# Altium schematic sheet Sheet1.SchDoc
size A4
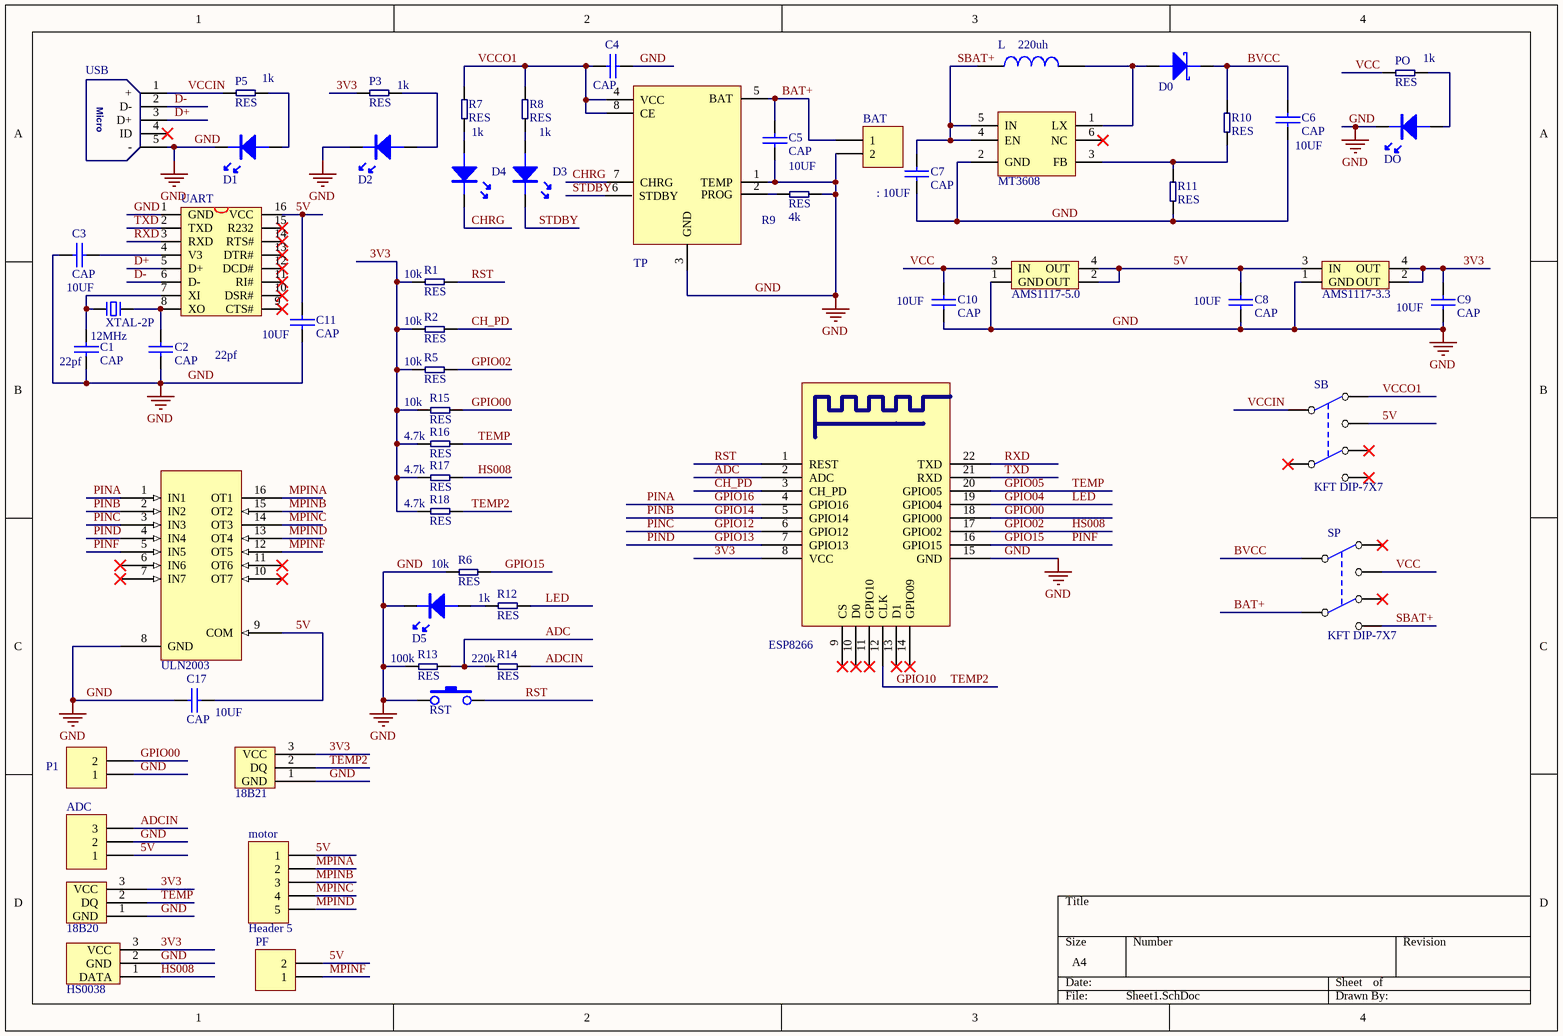
[diagram p0: Sheet1.SchDoc]

## Parts
18B20  DS18B20  [DS18B20]  (value not drawn)
18B21  DS18B20  [DS18B20]  (value not drawn)
ADC  Header 3  [HDR1X3]  (value not drawn)
AMS117  AMS1117-3.3  [AMS1117]
AMS117-1  AMS1117-5.0  [AMS1117]
BAT  Header 2  [HDR1X2]  (value not drawn)
C1  CAP  [0805C]
C2  CAP  [0805C]
C3  CAP  [0805C]
C4  CAP  [0805C]
C5  CAP  [0805C]
C6  CAP  [0805C]
C7  CAP  [0805C]
C8  CAP  [0805C]
C9  CAP  [0805C]
C10  CAP  [0805C]
C11  CAP  [0805C]
C17  CAP  [0805C]
D0  DIODE SCHOTTKY  [SMA/DO-214AC]  (value not drawn)
D1  LED  [LED-0805R]  (value not drawn)
D2  LED  [LED-0805R]  (value not drawn)
D3  LED  [LED-0805R]  (value not drawn)
D4  LED  [LED-0805R]  (value not drawn)
D5  LED  [LED-0805R]  (value not drawn)
DO  LED  [LED-0805R]  (value not drawn)
ESP8266  ESP8266  [ESP_12]
HS0038  HS0038  [HS0038]  (value not drawn)
L  INDUCTOR  [CD54]  (value not drawn)
motor  Header 5  [HDR1X5]
MT  MT3608  [SOT23-6]
P1  Header 2  [HDR1X2]  (value not drawn)
P3  RES  [0805R]
P5  RES  [0805R]
PF  Header 2  [HDR1X2]  (value not drawn)
PO  RES  [0805R]
R1  RES  [0805R]
R2  RES  [0805R]
R5  RES  [0805R]
R6  RES  [0805R]
R7  RES  [0805R]
R8  RES  [0805R]
R9  RES  [0805R]
R10  RES  [0805R]
R11  RES  [0805R]
R12  RES  [0805R]
R13  RES  [0805R]
R14  RES  [0805R]
R15  RES  [0805R]
R16  RES  [0805R]
R17  RES  [0805R]
R18  RES  [0805R]
RST  KEY  [DIP-3X6X4.3]  (value not drawn)
SB  KFT DIP-7X7  [KFT DIP-7X7]
SP  KFT DIP-7X7  [KFT DIP-7X7]
TP  TP4056  [SOP-8]  (value not drawn)
UART  CH340G  [SOP16M]  (value not drawn)
ULN2003  ULN2003  [SOP16]
USB  Micro-USB  [USB-MICRO_A]  (value not drawn)
X  XTAL-2P  [OSC HC-49S]

## Nets
GND: 18B20.1(GND) 18B21.1(GND) ADC.2 AMS117.1(GND) AMS117-1.1(GND) BAT.2 C1.1 C2.1 C3.2 C4.2 C5.1 C6.1 C7.1 C8.1 C9.1 C10.1 C11.1 C17.1 D1.K D2.K D5.K DO.K ESP8266.15(GND) HS0038.2(GND) MT.2(GND) P1.1 R6.1 R9.1 R11.2 R13.1 RST.1 TP.1(TEMP) TP.3(GND) UART.1(GND) ULN2003.8(GND) USB.5(-)
3V3: 18B20.3(VCC) 18B21.3(VCC) AMS117.2(OUT) AMS117.4(OUT) C9.2 ESP8266.8(VCC) HS0038.3(VCC) P3.1 R1.2 R2.2 R5.1 R15.1 R16.2 R17.2 R18.2
5V: ADC.1 AMS117.3(IN) AMS117-1.2(OUT) AMS117-1.4(OUT) C8.2 C11.2 C17.2 motor.1 PF.2 SB.1 UART.16(VCC) ULN2003.9(COM)
ADC: ESP8266.2(ADC) R13.2 R14.1
ADCIN: ADC.3 R14.2
BAT+: BAT.1 C5.2 SP.5 TP.5(BAT)
BVCC: C6.2 D0.K R10.2 SP.2
CH_PD: ESP8266.3(CH_PD) R2.1
CHRG: D4.K TP.7(CHRG)
D+: UART.5(D+) USB.3(D+)
D-: UART.6(D-) USB.2(D-)
GPIO00: ESP8266.18(GPIO00) P1.2 R15.2
GPIO02: ESP8266.17(GPIO02) HS0038.1(DATA) R5.2 R17.1  [also labelled HS008]
GPIO04: ESP8266.19(GPIO04) R12.2  [also labelled LED]
GPIO05: 18B20.2(DQ) ESP8266.20(GPIO05) R16.1  [also labelled TEMP]
GPIO10: 18B21.2(DQ) ESP8266.12(CLK) R18.1  [also labelled TEMP2]
GPIO12: ESP8266.6(GPIO12) ULN2003.3(IN3)  [also labelled PINC]
GPIO13: ESP8266.7(GPIO13) ULN2003.4(IN4)  [also labelled PIND]
GPIO14: ESP8266.5(GPIO14) ULN2003.2(IN2)  [also labelled PINB]
GPIO15: ESP8266.16(GPIO15) R6.2 ULN2003.5(IN5)  [also labelled PINF]
GPIO16: ESP8266.4(GPIO16) ULN2003.1(IN1)  [also labelled PINA]
MPINA: motor.2 ULN2003.16(OT1)
MPINB: motor.3 ULN2003.15(OT2)
MPINC: motor.4 ULN2003.14(OT3)
MPIND: motor.5 ULN2003.13(OT4)
MPINF: PF.1 ULN2003.12(OT5)
RST: ESP8266.1(REST) R1.1 RST.3
RXD: ESP8266.22(TXD) UART.3(RXD)
SBAT+: C7.2 L.1 MT.4(EN) MT.5(IN) SP.6
STDBY: D3.K TP.6(STDBY)
TXD: ESP8266.21(RXD) UART.2(TXD)
VCC: AMS117-1.3(IN) C10.2 PO.1 SP.1
VCCIN: P5.1 SB.2 USB.1(+)
VCCO1: C4.1 R7.2 R8.2 SB.3 TP.4(VCC) TP.8(CE)
NetC1_2: C1.2 UART.7(XI) X.2
NetC2_2: C2.2 UART.8(XO) X.1
NetC3_1: C3.1 UART.4(V3)
NetD0_A: D0.A L.2 MT.1(LX)
NetD1_A: D1.A P5.2
NetD2_A: D2.A P3.2
NetD3_A: D3.A R8.1
NetD4_A: D4.A R7.1
NetD5_A: D5.A R12.1
NetDO_A: DO.A PO.2
NetMT_3: MT.3(FB) R10.1 R11.1
NetR9_2: R9.2 TP.2(PROG)

Not connected (* = marked no-connect by the designer): ESP8266 9(CS)* 10(D0)* 11(GPIO10)* 13(D1)* 14(GPIO09)*; MT 6(NC)*; SB 4* 5* 6*; SP 3* 4*; UART 9(CTS#)* 10(DSR#)* 11(RI#)* 12(DCD#)* 13(DTR#)* 14(RTS#)* 15(R232)*; ULN2003 6(IN6)* 7(IN7)* 10(OT7)* 11(OT6)*; USB 4(ID)*

## Notes on the sheet
- (in symbol CAP) 22pf; 10UF
- (in symbol INDUCTOR) 220uh
- (in symbol Micro-USB) Micro
- (in symbol RES) 10k; 1k; 4k; 100k; 220k; 4.7k
- (in symbol XTAL-2P) 12MHz

## Library data of the parts
ADC = Header 3: Header, 3-Pin; LatestRevisionDate: 17-Jul-2002; LatestRevisionNote: Re-released for DXP Platform.; Publisher: Altium Limited
AMS117 AMS117-1 = AMS1117
BAT P1 PF = Header 2: Header, 2-Pin; LatestRevisionDate: 17-Jul-2002; LatestRevisionNote: Re-released for DXP Platform.; Publisher: Altium Limited
C1-C11 C17 = CAP: 无极性电容
D0 = DIODE SCHOTTKY: 肖特基二极管
motor = Header 5: Header, 5-Pin; LatestRevisionDate: 17-Jul-2002; LatestRevisionNote: Re-released for DXP Platform.; Publisher: Altium Limited
UART = CH340G: USB2UART
X = XTAL-2P: 2脚无源脚晶振